# Altium schematic sheet camm-brd.SchDoc
size 297 x 209 mm
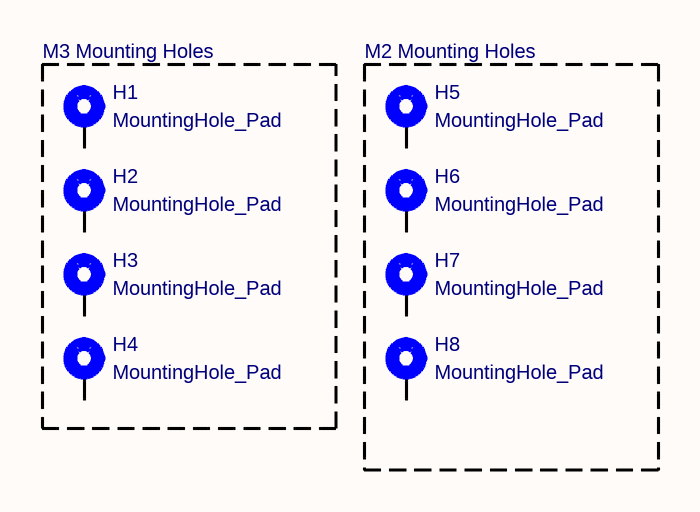
[diagram p0: camm-brd.SchDoc]

## Parts
H1  MountingHole_Pad  [MountingHole_3.2mm_M3_Pad_TopBottom]
H2  MountingHole_Pad  [MountingHole_3.2mm_M3_Pad_TopBottom]
H3  MountingHole_Pad  [MountingHole_3.2mm_M3_Pad_TopBottom]
H4  MountingHole_Pad  [MountingHole_3.2mm_M3_Pad_TopBottom]
H5  MountingHole_Pad  [MountingHole_2.2mm_M2_Pad_TopBottom]
H6  MountingHole_Pad  [MountingHole_2.2mm_M2_Pad_TopBottom]
H7  MountingHole_Pad  [MountingHole_2.2mm_M2_Pad_TopBottom]
H8  MountingHole_Pad  [MountingHole_2.2mm_M2_Pad_TopBottom]

## Blocks framed on the sheet
M3 Mounting Holes /: H1-H4
M2 Mounting Holes: H5-H8

## Nets

Not connected (* = marked no-connect by the designer): H1 1; H2 1; H3 1; H4 1; H5 1; H6 1; H7 1; H8 1

## Notes on the sheet
- 1
- 2
- 3
- 4
- 5
- 6
- A
- B
- C
- D
- Title:
- File: camm-brd.kicad_sch
- Sheet: /
- KiCad E.D.A.  kicad (5.1.4)-1
- Size: A4
- Date:
- Rev:
- Id: 1/1

## Library data of the parts
H1-H8 = MountingHole_Pad: Value: MountingHole_Pad
  H1-H4: Footprint: MountingHole:MountingHole_3.2mm_M3_Pad_TopBottom
  H5-H8: Footprint: MountingHole:MountingHole_2.2mm_M2_Pad_TopBottom